# EAGLE design 2DBarcodeScanner (EAGLE 9.5.2)
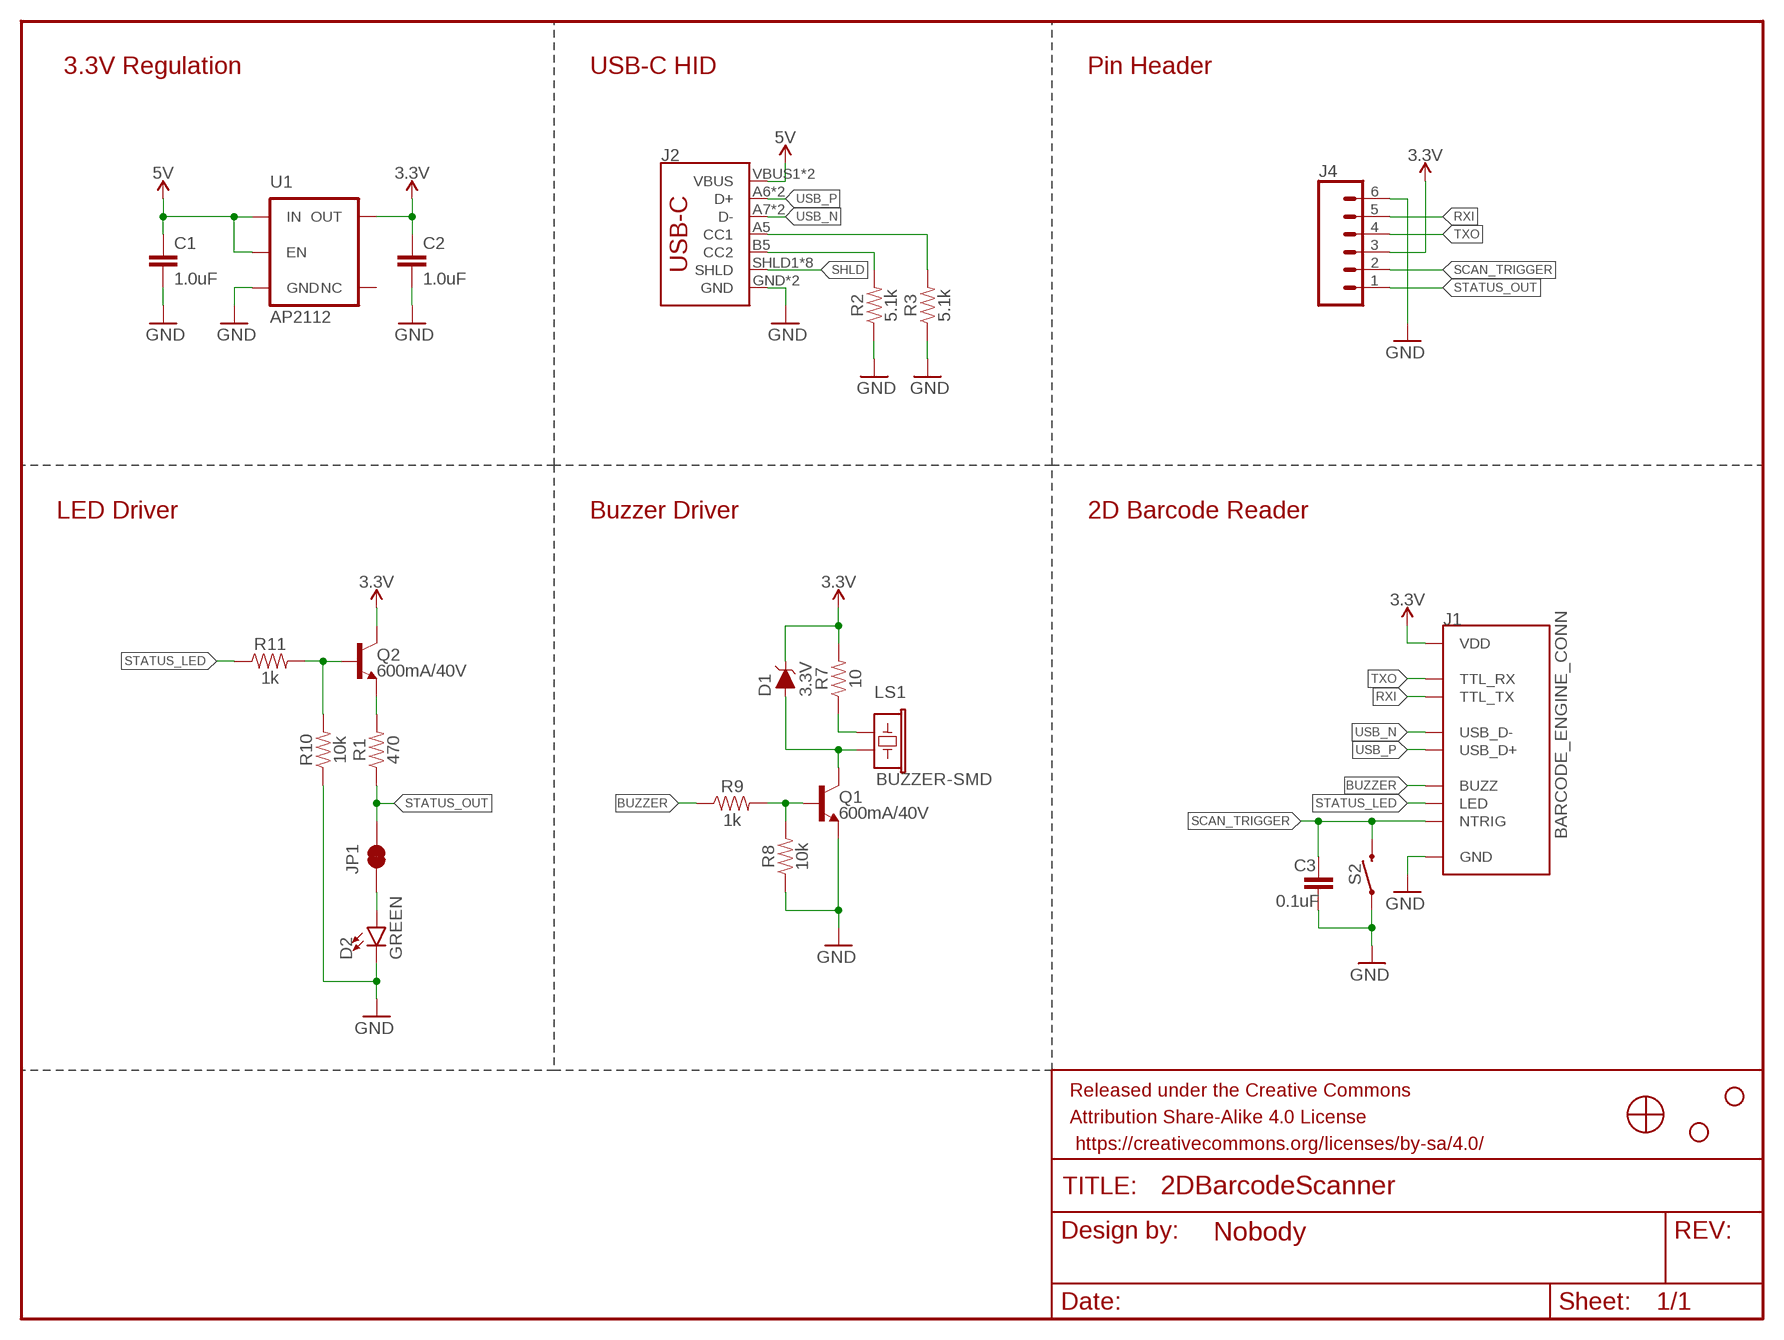
[diagram p0: schematic, sheet 1]

## Parts
C1  1.0uF  1.0UF-0603-16V-10%  [0603]
C2  1.0uF  1.0UF-0603-16V-10%  [0603]
C3  0.1uF  0.1UF-0603-25V-(+80/-20%)  [0603]
D1  3.3V  DIODE-ZENER-MM3Z3V3T1G  [SOD-323]
D2  GREEN  LED-GREEN0603  [LED-0603]
FRAME1  FRAME-LETTERNO_PACKAGE  [DUMMY]
H2  STAND-OFF  [STAND-OFF]
H3  STAND-OFF  [STAND-OFF]
J1  BARCODE_ENGINE_CONN  [CONN_FPC_BOTTOM_12POS_.5MM_R/A]
J2  USB_C2-LAYER  [USB-C-16P]
J4  CONN_06NO_SILK_FEMALE_PTH  [1X06_NO_SILK]
JP1  JUMPER-SMT_2_NC_TRACE_SILK  [SMT-JUMPER_2_NC_TRACE_SILK]
LS1  BUZZER-SMD  [BUZZER-CCV]
Q1  600mA/40V  TRANS_NPN-MMBT2222AL  [SOT23-3]
Q2  600mA/40V  TRANS_NPN-MMBT2222AL  [SOT23-3]
R1  470  470OHM-0603-1/10W-1%  [0603]
R2  5.1k  5.1KOHM5.1KOHM-0603-1/10W-1%  [0603]
R3  5.1k  5.1KOHM5.1KOHM-0603-1/10W-1%  [0603]
R7  10  10OHM-0603-1/10W-5%  [0603]
R8  10k  10KOHM-0603-1/10W-1%  [0603]
R9  1k  1KOHM-0603-1/10W-1%  [0603]
R10  10k  10KOHM-0603-1/10W-1%  [0603]
R11  1k  1KOHM-0603-1/10W-1%  [0603]
S2  MOMENTARY-SWITCH-SPST-SMD-5.2MM-TALL  [TACTILE_SWITCH_SMD_5.2MM]
U1  3.3V  V_REG_AP2112K-3.3V  [SOT23-5]
U$1  BARCODE_SCANNER_MOUNT  [BARCODE_SCANNER_MOUNT]

## Nets
3.3V [power]: C2.1 D1.C J1.P$11(VDD) J4.3 Q2.3(C) R7.2 U1.5(OUT)
5V: C1.1 J2.VBUS1(VBUS) J2.VBUS2(VBUS) U1.1(IN) U1.3(EN)
BUZZER: J1.P$4(BUZZ) R9.1
CC3: J2.A5(CC1) R3.2
CC4: J2.B5(CC2) R2.2
GND [power]: C1.2 C2.2 C3.2 D2.C J1.P$10(GND) J1.P$13(GND) J1.P$14(GND) J2.GND J2.GND2(GND) J4.6 Q1.2(E) R2.1 R3.1 R8.1 R10.1 S2.1 U1.2(GND)
N$2: D1.A LS1.- Q1.3(C)
N$3: LS1.+ R7.1
N$4: Q2.2(E) R1.2
N$5: Q1.1(B) R8.2 R9.2
N$7: Q2.1(B) R10.2 R11.2
N$8: D2.A JP1.1
RXI: J1.P$8(TTL_TX) J4.5
SCAN_TRIGGER: C3.1 J1.P$1(NTRIG) J4.2 S2.3
SHLD: J2.SHLD1(SHLD) J2.SHLD2(SHLD) J2.SHLD3(SHLD) J2.SHLD4(SHLD) J2.SHLD5(SHLD) J2.SHLD6(SHLD) J2.SHLD7(SHLD) J2.SHLD8(SHLD)
STATUS_LED: J1.P$3(LED) R11.1
STATUS_OUT: J4.1 JP1.2 R1.1
TXO: J1.P$9(TTL_RX) J4.4
USB_N: J1.P$7(USB_D-) J2.A7(D-) J2.B7(D-)
USB_P: J1.P$6(USB_D+) J2.A6(D+) J2.B6(D+)
Unconnected: U1.4(NC)

## Notes on the sheet
- 3.3V Regulation | USB-C HID | Pin Header
- AP2112
- LED Driver | Buzzer Driver | 2D Barcode Reader

## Library data of the parts
C1 C2 = SparkFun-Capacitors:1.0UF: 1µF ceramic capacitors A capacitor is a passive two-terminal electrical component used to store electrical energy temporarily in an electric field.; PROD_ID: CAP-00868
C3 = SparkFun-Capacitors:0.1UF: 0.1µF ceramic capacitors A capacitor is a passive two-terminal electrical component used to store electrical energy temporarily in an electric field.; PROD_ID: CAP-00810
D1 = SparkFun-DiscreteSemi:DIODE-ZENER: Zener Diode A Zener diode allows current to flow from its anode to its cathode like a normal semiconductor diode, but it also permits current to flow in the reverse direction when its "Zener voltage" is reached. - WIkipedia; PROD_ID: DIO-11284
D2 = SparkFun-LED:LED-GREEN: Green SMD LED Used in manufacturing of various products at SparkFun Packages: 0603 - SMD 0603 package [Product Link] <http://www.futureelectronics.com/en/technologies/semiconductors/optoelectronics/leds/Pages/9894312-LTST-C190GKT.aspx?CrossPart=HSMG-C190&IM=0> LilyPad 1206 - SMD1206 LilyPad package [Product Link] <http://www.futureelectronics.com/en/Technologies/Product.aspx?ProductID=IN150NGHARVATEKCORPORATION2049943&IM=0> 1206 - SMD1206 package [Product Link] <http://www.futureelectronics.com/en/technologies/semiconductors/optoelectronics/leds/Pages/8315665-LTST-C150KGKT.aspx?IM=0> 1206 Bottom Mount -SMD 1206 Bottom Mount [Product Link] <http://www.digikey.com/product-detail/en/lite-on-inc/LTST-C230KGKT/160-1456-1-ND/386854> SparkFun Products: Pro Mini 328 -5V <https://www.sparkfun.com/products/821> RedBoard <https://www.sparkfun.com/products/12757> MP3 Trigger <https://www.sparkfun.com/products/13720> Makey Makey <https://www.sparkfun.com/products/11076>; PROD_ID: DIO-00821
FRAME1 = SparkFun-Aesthetics:FRAME-LETTER: Schematic Frame - Letter Standard 8.5x11 US Letter frame; DESIGNER: Nobody; VERSION: v01
H2 H3 = SparkFun-Hardware:STAND-OFF: Stand Off Drill holes for mechanically mounting via screws, standoffs, etc. Note: Use the keepout ring to avoid running the screw head into surrounding components. Variant Overviews STAND-OFF - Mechanical footprint for a #4 phillips button head screw. STAND-OFF-TIGHT - Mechanical footprint for a #4 phillips button head screw, Example SparkFun Products Screw - Phillips Head (1/4", 4-40, 10 pack) <https://www.sparkfun.com/products/10453> (PRT-10453) Screw - Phillips Head (1/2", 4-40, 10 pack) <https://www.sparkfun.com/products/10452> (PRT-10452) Screw - Phillips Head (3/4", 4-40, 10 pack) <https://www.sparkfun.com/products/10451> (PRT-10451) Screw - Phillips Head (1", 4-40, 10 pack) <https://www.sparkfun.com/products/10450> (PRT-10450)
J1 = SparkFun-Connectors:BARCODE_ENGINE_CONN
J2 = SparkFun-Connectors:USB_C: USB Type C 16Pin Connector Super Speed pins not available on the 16-pin purely SMD connector so this part is best for USB 2.0 implementations. D1 and D2 are tied together enabling D+/- no matter which way the cable is plugged into the connector. The two channel configuration pins (CC1/2) are exposed. These are normally connected to ground via 5.1k resistors but can be reconfigured for high current/high power applications.; PROD_ID: CONN-14122
J4 = SparkFun-Connectors:CONN_06: Multi connection point. Often used as Generic Header-pin footprint for 0.1 inch spaced/style header connections On any of the 0.1 inch spaced packages, you can populate with these: Break Away Headers - Straight <https://www.sparkfun.com/products/116> (PRT-00116) Break Away Male Headers - Right Angle <https://www.sparkfun.com/products/553> (PRT-00553) Female Headers <https://www.sparkfun.com/products/115> (PRT-00115) Break Away Headers - Machine Pin <https://www.sparkfun.com/products/117> (PRT-00117) Break Away Female Headers - Swiss Machine Pin <https://www.sparkfun.com/products/743> (PRT-00743) Arduino Stackable Header - 6 Pin <https://www.sparkfun.com/products/9280> (PRT-09280) For SCREWTERMINALS and SPRING TERMINALS visit here: Screw Terimnals on SparkFun.com <https://www.sparkfun.com/search/results?term=Screw+Terminals> (5mm/3.5mm/2.54mm spacing) This device is also useful as a general connection point to wire up your design to another part of your project. Our various solder wires solder well into these plated through hole pads. Hook-Up Wire - Assortment (Stranded, 22 AWG) <https://www.sparkfun.com/products/11375> (PRT-11375) Hook-Up Wire - Assortment (Solid Core, 22 AWG) <https://www.sparkfun.com/products/11367> (PRT-11367) View the entire wire category on our website here <https://www.sparkfun.com/categories/141>; PROD_ID: CONN-08437
JP1 = SparkFun-Jumpers:JUMPER-SMT_2_NC_TRACE: Normally closed trace jumper This jumper has a trace between two pads so it's normally closed (NC). Use a razor knife to open the connection. For best results follow the IPC guidelines for cutting traces: Cutout at least 0.063 mm (0.005 in). Remove all loose material to clean up the cut area. Seal the cut with an approved epoxy. Reapply solder to reclose the connection.
LS1 = SparkFun-Electromechanical:BUZZER: Buzzer Small round buzzers that operate around the audible 2kHz range. You can use these as speakers to create simple music or user interfaces. Variant Overview: PTH - Mini Speaker - PC Mount 12mm 2.048kHz <https://www.sparkfun.com/products/7950> PTH_KIT - Mini Speaker - PC Mount 12mm 2.048kHz <https://www.sparkfun.com/products/7950> KIT simplifies soldering by adding stop mask to one side of the pads. PTH_NO_SILK - Mini Speaker - PC Mount 12mm 2.048kHz <https://www.sparkfun.com/products/7950> No silkscreen indicator of buzzer outline. PTH_KIT_NO_SILK - Mini Speaker - PC Mount 12mm 2.048kHz <https://www.sparkfun.com/products/7950> KIT package w/o silkscreen SMD - Buzzer Audio Magnetic (CCV-084B16) SMD buzzer used on, e.g. the LilyPad Buzzer <https://www.sparkfun.com/products/8463> and RFID USB Reader <https://www.sparkfun.com/products/9963>. SMD_KIT - Buzzer Audio Magnetic (CCV-084B16) SMD Buzzer with elongated pins to make soldering easier. Used on the SparkFun Simon Says - Surface Mount Soldering Kit <https://www.sparkfun.com/products/10935>.; PROD_ID: COMP-08568
Q1 Q2 = SparkFun-DiscreteSemi:TRANS_NPN: NPN transistor Current controlled devices typically used to amplify current or used as a switch. BC547 - COM-08928 <http://www.sparkfun.com/products/8928> (TO-92 45V 100mA) (1.Collector 2.Base 3.Emitter) 2N3904 - COM-00521 <http://www.sparkfun.com/products/521> (TO-92 40V 200mA) (1.Emitter 2.Base 3.Collector) P2N2222A - COM-12852 <http://www.sparkfun.com/products/12852> (TO-92 40V 600mA) (1.Collector 2.Base 3.Emitter); PROD_ID: TRANS-08049
R1 = SparkFun-Resistors:470OHM: 470Ω resistor A resistor is a passive two-terminal electrical component that implements electrical resistance as a circuit element. Resistors act to reduce current flow, and, at the same time, act to lower voltage levels within circuits. - Wikipedia; PROD_ID: RES-07869
R2 R3 = SparkFun-Resistors:5.1KOHM; PROD_ID: RES-12083
R7 = SparkFun-Resistors:10OHM: 10Ω resistor A resistor is a passive two-terminal electrical component that implements electrical resistance as a circuit element. Resistors act to reduce current flow, and, at the same time, act to lower voltage levels within circuits. - Wikipedia; PROD_ID: RES-09834
R8 R10 = SparkFun-Resistors:10KOHM: 10kΩ resistor A resistor is a passive two-terminal electrical component that implements electrical resistance as a circuit element. Resistors act to reduce current flow, and, at the same time, act to lower voltage levels within circuits. - Wikipedia; PROD_ID: RES-00824
R9 R11 = SparkFun-Resistors:1KOHM: 1kΩ resistor A resistor is a passive two-terminal electrical component that implements electrical resistance as a circuit element. Resistors act to reduce current flow, and, at the same time, act to lower voltage levels within circuits. - Wikipedia; PROD_ID: RES-07856
S2 = SparkFun-Switches:MOMENTARY-SWITCH-SPST: Momentary Switch (Pushbutton) - SPST Normally-open (NO) SPST momentary switches (buttons, pushbuttons). Variants PTH-12MM - 12mm square, through-hole Momentary Pushbutton Switch - 12mm Square <https://www.sparkfun.com/products/9190> (COM-09190) PTH-6.0MM, PTH-6.0MM-KIT - 6.0mm square, through-hole Mini Pushbutton Switch <https://www.sparkfun.com/products/97> (COM-00097) KIT package intended for soldering kit's - only one side of pads' copper is exposed. PTH-RIGHT-ANGLE-KIT - Right-angle, through-hole Right Angle Tactile Button <https://www.sparkfun.com/products/10791> - Used on SparkFun BigTime Watch Kit <https://www.sparkfun.com/products/11734> SMD-12MM - 12mm square, surface-mount Tactile Button - SMD (12mm) <https://www.sparkfun.com/products/12993> (COM-12993) Used on SparkFun PicoBoard <https://www.sparkfun.com/products/11888> SMD-4.5MM - 4.5mm Square Trackball Switch Used on SparkFun Blackberry Trackballer Breakout <https://www.sparkfun.com/products/13169> SMD-4.6MMX2.8MM - 4.60mm x 2.80mm, surface mount Used on SparkFun SAMD21 Mini Breakout <https://www.sparkfun.com/products/13664> SMD-5.2MM, SMD-5.2-REDUNDANT - 5.2mm square, surface-mount Mini Pushbutton Switch - SMD <https://www.sparkfun.com/products/8720> (COM-08720) Used on Arduino Pro Mini <https://www.sparkfun.com/products/11114> REDUNDANT package connects both switch circuits together SMD-6.0X3.5MM - 6.0 x 3.5mm, surface mount Momentary Reset Switch SMD <https://www.sparkfun.com/products/8229> (COM-08229) SMD-6.2MM-TALL - 6.2mm square, surface mount Tactile Button - SMD (6mm) <https://www.sparkfun.com/products/12992> Used on SparkFun Digital Sandbox <https://www.sparkfun.com/products/12651> SMD-RIGHT-ANGLE - Right-angle, surface mount Used on SparkFun Block for Intel® Edison - Arduino <https://www.sparkfun.com/products/13036>; PROD_ID: SWCH-14139
U1 = SparkFun-IC-Power:V_REG_AP2112: AP2112 - 600mA CMOS LDO Regulator w/ Enable The AP2112 is CMOS process low dropout linear regulator with enable function, the regulator delivers a guaranteed 600mA (min.) continuous load current. Features Output Voltage Accuracy: ±1.5% Output Current: 600mA (Min.) Foldback Short Current Protection: 50mA Enable Function to Turn ON/OFF VOUT Low Dropout Voltage (3.3V): 250mV (Typ.) @IOUT=600mA Excellent Load Regulation: 0.2%/A (Typ.) Excellent Line Regulation: 0.02%/V (Typ.) Low Quiescent Current: 55μA (Typ.) Low Standby Current: 0.01μA (Typ.) Low Output Noise: 50μVRMS PSRR: 100Hz -65dB, 1kHz -65dB OTSD Protection Stable with 1.0μF Flexible Cap: Ceramic, Tantalum and Aluminum Electrolytic Operation Temperature Range: -40°C to 85°C ESD: MM 400V, HBM 4000V; PROD_ID: VREG-12457
U$1 = SparkFun-Hardware:BARCODE_SCANNER_MOUNT

## Net classes
1 power: width 0.178 mm

## Board
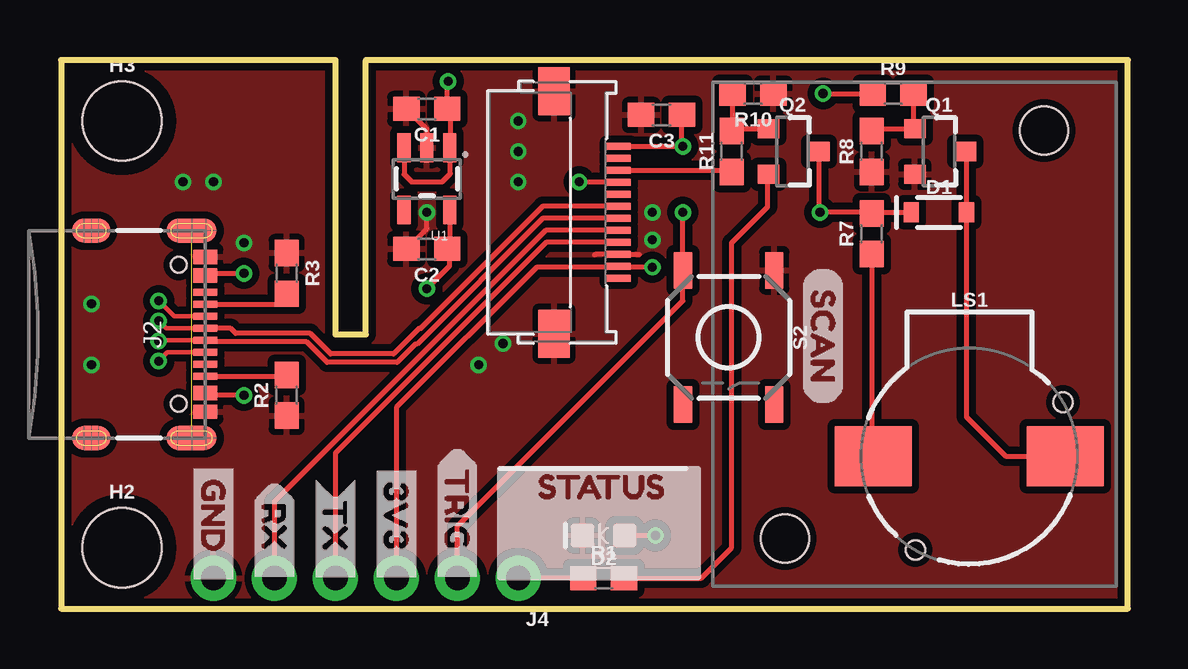
[diagram p1: board, top side]
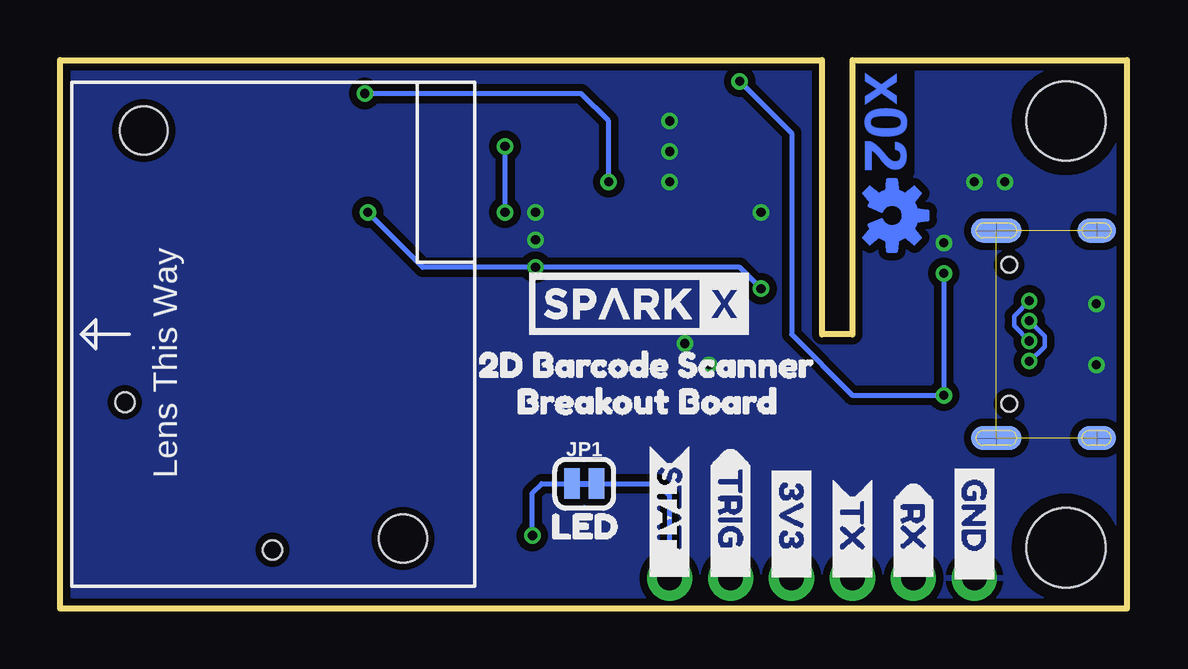
[diagram p2: board, bottom side, seen from below]

Size 44.45 x 22.86 mm. Coordinates in mm from the lower left corner, seen from the top.
Outline: 11.43,22.86 11.43,11.43 12.7,11.43 12.7,22.86 44.45,22.86 44.45,0 0,0 0,22.86 11.43,22.86
Copper layers (1*16): Top 0.035mm / dielectric 1.5mm / Bottom 0.035mm
Design rules "SparkFun-2-layer-PCBWay-LIMIT": minimum track width 6mil, minimum drill 0.3mm, track to track 6mil, track to pad 6mil, pad to pad 6mil, via to via 6mil, smd to smd 6mil, copper to edge 6mil, drill to drill 6mil, minimum pad ring 6mil, minimum via ring 6mil, stop-mask expansion 4mil, vias tented up to drill 25mil, thermal gap 10mil

### Footprints (pad centres in the part's own frame; a part is rotated, then mirrored left to right if it is on the bottom)
0603 = smd 1.1 x 1: 1 -0.85,0; 2 0.85,0
SOD-323 = smd 0.63 x 0.83: A 1.15,0; C -1.15,0
LED-0603 = smd 1 x 1: A -0.877,0; C 0.877,0
STAND-OFF = hole 3.302: 0,0
CONN_FPC_BOTTOM_12POS_.5MM_R/A = smd 0.3 x 1: P$1 -2.75,0; P$2 -2.25,0; P$3 -1.75,0; P$4 -1.25,0; P$5 -0.75,0; P$6 -0.25,0; P$7 0.25,0; P$8 0.75,0; P$9 1.25,0; P$10 1.75,0; P$11 2.25,0; P$12 2.75,0 | smd 2 x 1.3: P$13 -5.05,-2.7; P$14 5.05,-2.7
USB-C-16P = smd 0.3 x 1: A5 -1.25,-0.34; A6 -0.25,-0.34; A7 0.25,-0.34; A8 1.25,-0.34; B5 1.75,-0.34; B6 0.75,-0.34; B7 -0.75,-0.34; B8 -1.75,-0.34 | smd 0.6 x 1: GND -3.225,-0.34; GND2 3.225,-0.34; VBUS1 -2.45,-0.34; VBUS2 2.45,-0.34 | smd 1 x 2.1: SHLD1 -4.32,-0.915; SHLD2 4.32,-0.915 | smd 1 x 2.1 bottom: SHLD3 -4.32,-0.915; SHLD4 4.32,-0.915 | smd 1 x 1.6: SHLD5 -4.32,-5.095; SHLD8 4.32,-5.095 | smd 1 x 1.6 bottom: SHLD6 -4.32,-5.095; SHLD7 4.32,-5.095 | hole 0.65: -2.89,-1.445; 2.89,-1.445
1X06_NO_SILK = drill 1.016 pad 1.88: 1 0,0; 2 2.54,0; 3 5.08,0; 4 7.62,0; 5 10.16,0; 6 12.7,0
SMT-JUMPER_2_NC_TRACE_SILK = smd 0.635 x 1.27: 1 -0.508,0; 2 0.508,0
BUZZER-CCV = smd 3.2 x 2.5: + 4,0; - -4,0 | hole 0.8: -3.9,-2.25; 2.25,3.9
SOT23-3 = smd 0.8 x 0.9: 1 -0.95,-1; 2 0.95,-1; 3 0,1.1
TACTILE_SWITCH_SMD_5.2MM = smd 1.524 x 0.762: 1 -2.794,1.905; 2 2.794,1.905; 3 -2.794,-1.905; 4 2.794,-1.905
SOT23-5 = smd 0.55 x 1.2: 1 -0.95,-1.3; 2 0,-1.3; 3 0.95,-1.3; 4 0.95,1.3; 5 -0.95,1.3
BARCODE_SCANNER_MOUNT = hole 2: -5.4,8.5; 5.4,-8.5

### Placement (x,y rotation side)
C1  15.24,20.83 180 top
C2  15.24,14.99 180 top
C3  25.02,20.57 180 top
D1  36.58,16.51 0 top
D2  22.61,3.05 180 top
FRAME1  0,0 0 top
H2  2.54,2.54 0 top
H3  2.54,20.32 0 top
J1  23.24,16.51 270 top
J2  6.35,11.43 270 top
J4  19.05,1.27 180 top
JP1  22.61,5.21 0 bottom
LS1  37.85,6.35 180 top
Q1  36.58,19.05 270 top
Q2  30.48,19.05 270 top
R1  22.61,1.27 0 top
R2  9.4,8.89 90 top
R3  9.4,13.97 270 top
R7  33.78,15.62 90 top
R8  33.78,19.05 90 top
R9  34.67,21.46 0 top
R10  28.83,21.46 180 top
R11  27.94,19.05 90 top
S2  27.81,11.3 270 top
U1  15.24,17.91 180 top
U$1  35.56,11.43 180 bottom
U$2  [STATUS3]  18.92,5.08 0 top
U$3  [STAT__5]  19.05,6.86 270 bottom
U$4  [TRIG__4]  16.51,6.73 270 bottom
U$5  [TRIG__4]  16.51,6.73 270 top
U$6  [3V3__3]  13.97,6.22 270 top
U$7  [SCAN4]  31.75,14.22 270 top
U$8  [LED0]  24.89,3.43 0 bottom
U$9  [3V3__3]  13.97,6.22 270 bottom
U$10  [TX__2]  11.43,5.46 270 bottom
U$11  [TX__2]  11.43,5.46 270 top
U$12  [RX__1]  8.89,5.33 270 top
U$13  [RX__1]  8.89,5.33 270 bottom
U$14  [GND__0]  6.35,6.35 270 bottom
U$15  [GND__0]  6.35,6.35 270 top
U$17  [2D_BARCODE_SCANNER0]  27.94,10.16 0 bottom
U$18  [BREAKOUT_BOARD1]  26.29,8.64 0 bottom
U$20  [SPARKX-MEDIUM]  20.32,12.7 0 bottom
U$21  [OSHW-LOGO-S_COPPER]  9.78,16.38 270 bottom

### Tracks (layer width: path | path; a pad name or v marks a point on that pad's centre or on a via)
3.3V  (via drill 0.38)
  Top 0.203: J1.P$11 23.2,14.22 | 23.2,14.22 19.81,14.22 13.97,8.38 J4.3 | v24.64,14.22 23.2,14.22 | Q2.3 31.58,16.55 v31.62,16.51 33.74,16.51 R7.2 33.82,16.51 D1.C | 16.19,15.09 C2.1 | U1.5 16.19,15.09 | 16.19,15.09 16.19,14.29 v15.24,13.34
  Bottom 0.203: v15.24,13.34 16.13,14.22 v24.64,14.22 29.34,14.22 v31.62,16.51
5V  (via drill 0.38)
  Top 0.178: 16.22,19.18 U1.1
  Top 0.203: J2.VBUS1 6.1,13.97 v7.62,13.97 | v7.62,8.89 6.1,8.89 J2.VBUS2 | v16.13,21.97 16.09,21.93 C1.1 16.22,20.7 16.22,19.18 16.22,18.12 15.88,17.78 14.61,17.78 14.29,18.09 U1.3
  Bottom 0.203: v7.62,13.97 v7.62,8.89 11.43,8.89 13.97,11.43 13.97,19.81 v16.13,21.97
BUZZER  (via drill 0.38)
  Top 0.203: J1.P$4 21.61,17.76 v21.59,17.78 | v31.75,21.46 R9.1
  Bottom 0.203: v21.59,17.78 21.59,20.32 22.73,21.46 v31.75,21.46
CC3
  Top 0.178: J2.A5 6.29,12.68
  Top 0.203: 6.29,12.68 8.96,12.68 R3.2
CC4
  Top 0.203: J2.B5 9.34,9.68 R2.2
GND  (via drill 0.38)
  Top 0.203: 22.23,14.73 22.25,14.76 J1.P$10 24.1,14.76 | C1.2 15.24,19.98 U1.2 | C2.2 15.24,15.84 v15.24,16.51
  other vias: 6.35,17.78 5.08,17.78 7.62,15.24 1.27,12.7 1.27,10.16 18.41,11.05 17.4,10.16 24.64,16.51 24.64,15.37 19.05,20.32 19.05,19.05 19.05,17.78
  pour Top (isolate 0.305): 0,0 44.45,0 44.45,22.86 0,22.86
  pour Bottom (isolate 0.305): 0,22.86 0,0 44.45,0 44.45,22.86
N$2
  Top 0.178: Q1.3 37.73,19
  Top 0.203: 37.73,19 D1.A 37.73,7.99 39.37,6.35 LS1.-
N$3
  Top 0.203: R7.1 33.78,6.41 LS1.+
N$4
  Top 0.203: Q2.2 29.44,18.06 29.44,16.74 27.94,15.24 27.94,2.54 26.67,1.27 R1.2
N$5
  Top 0.203: R8.2 33.88,20 Q1.1 35.52,20.05 R9.2
N$7
  Top 0.203: R10.2 27.98,19.94 R11.2 28.04,20 Q2.1
N$8  (via drill 0.38)
  Top 0.203: D2.A v24.77,3.05
  Bottom 0.203: JP1.1 24.38,5.21 24.77,4.83 v24.77,3.05
RXI
  Top 0.203: J1.P$8 20.2,15.76 8.89,4.45 J4.5
SCAN_TRIGGER  (via drill 0.38)
  Top 0.203: J1.P$1 v25.91,19.26 25.87,19.3 C3.1 | v25.91,16.51 S2.3 25.91,12.83 16.51,3.43 J4.2
  Bottom 0.203: v25.91,16.51 v25.91,19.26
SHLD  (7 unrouted)
STATUS_LED
  Top 0.203: J1.P$3 27.88,18.26 R11.1
STATUS_OUT
  Top 0.203: R1.1 J4.1
  Bottom 0.203: JP1.2 19.56,5.21 19.05,4.7 J4.1
TXO
  Top 0.203: J1.P$9 20.21,15.26 11.43,6.48 J4.4
USB_N  (via drill 0.38)
  Top 0.178: J2.B7 4.71,12.18 v4.06,12.83 | J2.A7 4.09,11.18 v4.06,11.15
  Top 0.203: J1.P$7 20.07,16.26 14.84,11.03 14.77,11.03 14,10.26 11.08,10.26 10.23,11.12 6.07,11.12 J2.A7
  Bottom 0.178: v4.06,12.83 4.7,12.19 4.7,11.79 v4.06,11.15
USB_P  (via drill 0.38)
  Top 0.178: J2.A6 4.37,11.68 v4.06,11.99 | J2.B6 4.43,10.68 v4.06,10.31
  Top 0.203: J1.P$6 20.07,16.76 14.99,11.68 14.92,11.68 13.86,10.62 11.23,10.62 10.38,11.47 7.27,11.47 7.07,11.68 J2.A6
  Bottom 0.178: v4.06,11.99 3.43,11.35 3.43,10.92 4.04,10.31 v4.06,10.31

### Text on the board
Bottom: x02